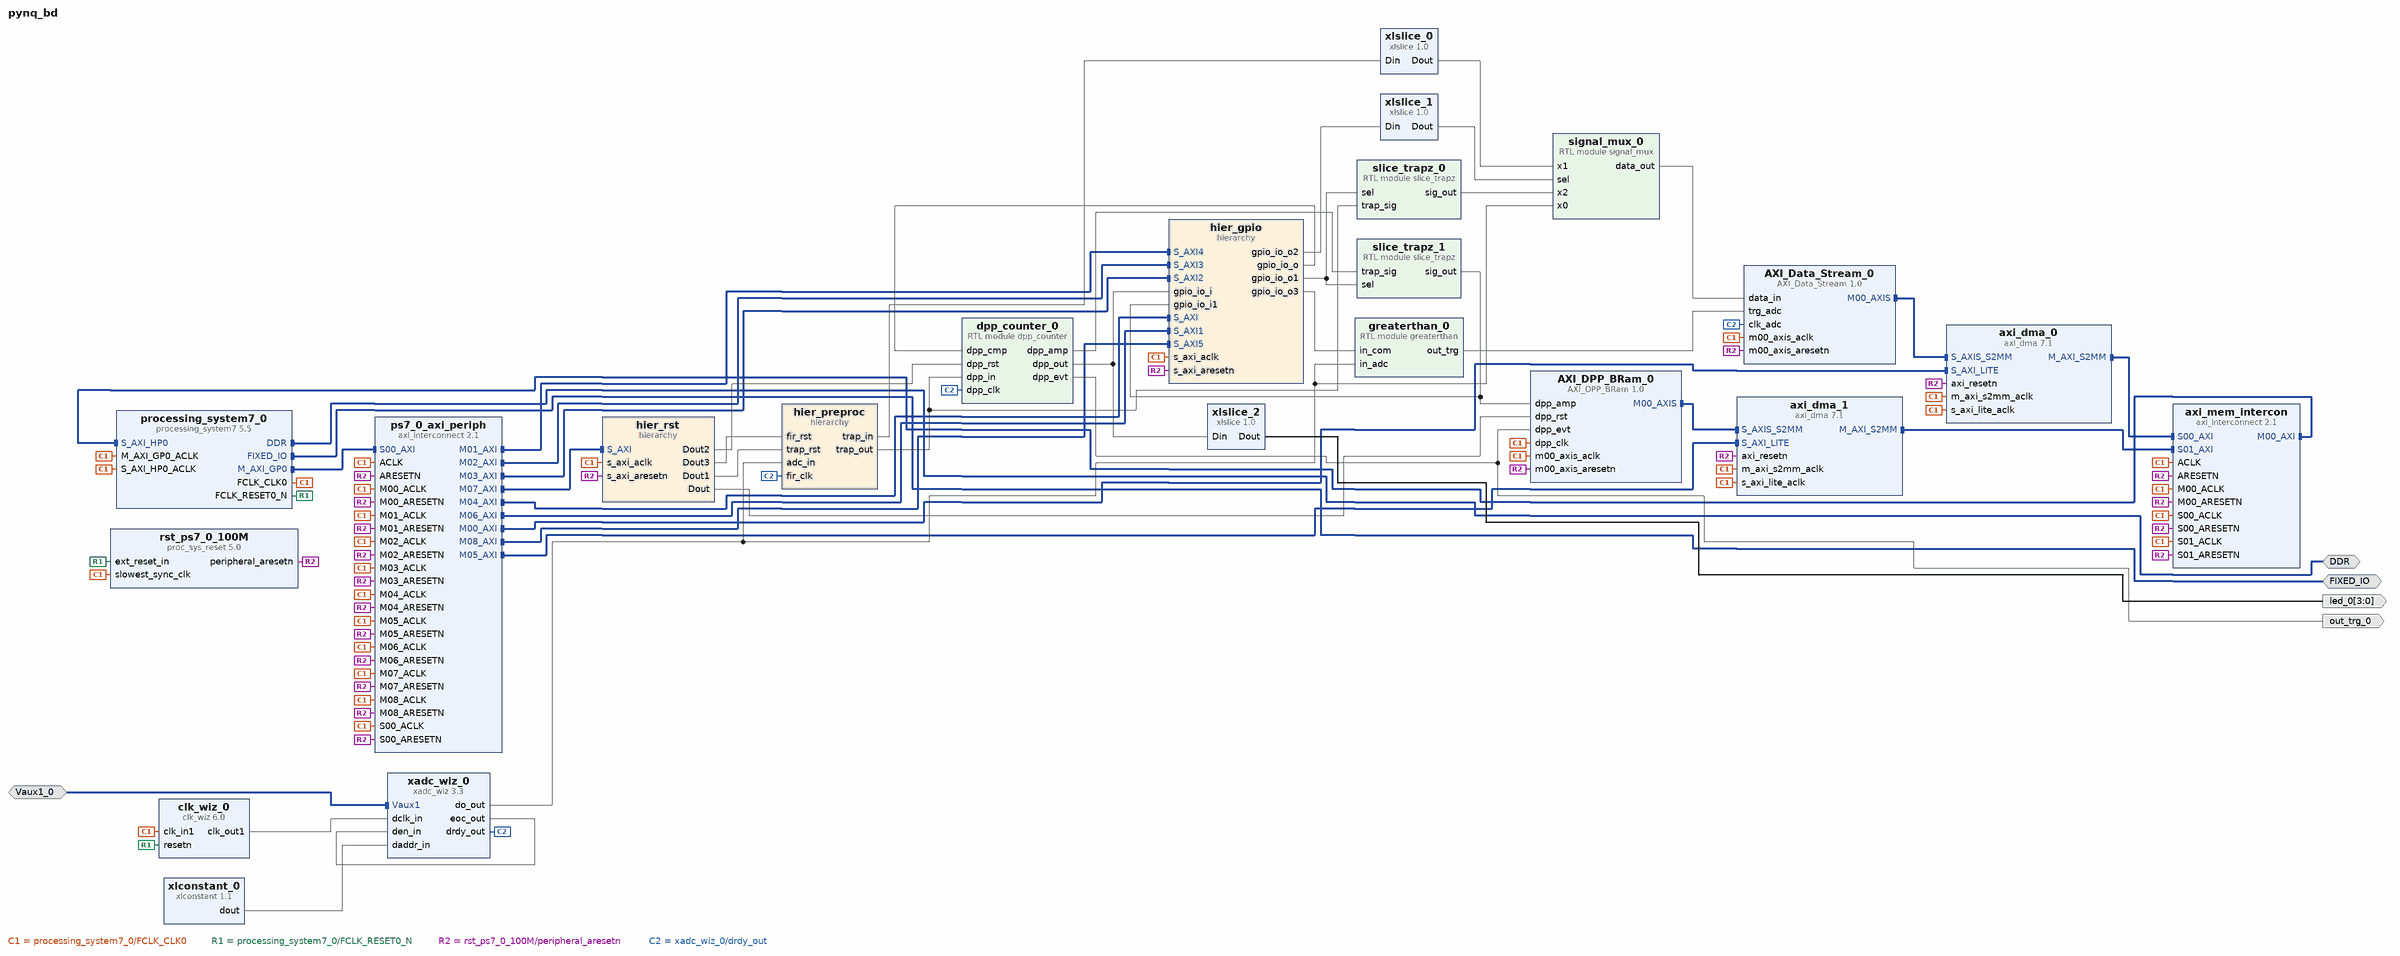
[diagram p0: block diagram of the top level]
# Vivado block design pynq_bd, xc7z020clg400-1, Vivado 2022.2
create_bd_design pynq_bd

create_bd_intf_port -mode Master -vlnv xilinx.com:interface:ddrx_rtl:1.0 DDR
create_bd_intf_port -mode Master -vlnv xilinx.com:display_processing_system7:fixedio_rtl:1.0 FIXED_IO
create_bd_intf_port -mode Slave -vlnv xilinx.com:interface:diff_analog_io_rtl:1.0 Vaux1_0
create_bd_port -dir O -from 3 -to 0 led_0
create_bd_port -dir O out_trg_0

create_bd_cell -type ip -vlnv xilinx.com:ip:processing_system7:5.5 processing_system7_0
set_property -dict [list \
  CONFIG.PCW_APU_PERIPHERAL_FREQMHZ 650 \
  CONFIG.PCW_CRYSTAL_PERIPHERAL_FREQMHZ 50 \
  CONFIG.PCW_ENET0_ENET0_IO {MIO 16 .. 27} \
  CONFIG.PCW_ENET0_GRP_MDIO_ENABLE 1 \
  CONFIG.PCW_ENET0_GRP_MDIO_IO {MIO 52 .. 53} \
  CONFIG.PCW_ENET0_PERIPHERAL_ENABLE 1 \
  CONFIG.PCW_ENET0_RESET_ENABLE 1 \
  CONFIG.PCW_ENET0_RESET_IO {MIO 9} \
  CONFIG.PCW_ENET_RESET_ENABLE 1 \
  CONFIG.PCW_ENET_RESET_SELECT {Share reset pin} \
  CONFIG.PCW_FPGA0_PERIPHERAL_FREQMHZ 100 \
  CONFIG.PCW_FPGA1_PERIPHERAL_FREQMHZ 50 \
  CONFIG.PCW_GPIO_MIO_GPIO_ENABLE 1 \
  CONFIG.PCW_GPIO_MIO_GPIO_IO MIO \
  CONFIG.PCW_I2C_RESET_ENABLE 0 \
  CONFIG.PCW_M_AXI_GP0_FREQMHZ 10 \
  CONFIG.PCW_PERIPHERAL_BOARD_PRESET None \
  CONFIG.PCW_PRESET_BANK1_VOLTAGE {LVCMOS 1.8V} \
  CONFIG.PCW_QSPI_GRP_FBCLK_ENABLE 1 \
  CONFIG.PCW_QSPI_GRP_FBCLK_IO {MIO 8} \
  CONFIG.PCW_QSPI_GRP_SINGLE_SS_ENABLE 1 \
  CONFIG.PCW_QSPI_GRP_SINGLE_SS_IO {MIO 1 .. 6} \
  CONFIG.PCW_QSPI_PERIPHERAL_ENABLE 1 \
  CONFIG.PCW_QSPI_QSPI_IO {MIO 1 .. 6} \
  CONFIG.PCW_SD0_GRP_CD_ENABLE 1 \
  CONFIG.PCW_SD0_GRP_CD_IO {MIO 47} \
  CONFIG.PCW_SD0_GRP_WP_ENABLE 0 \
  CONFIG.PCW_SD0_PERIPHERAL_ENABLE 1 \
  CONFIG.PCW_SD0_SD0_IO {MIO 40 .. 45} \
  CONFIG.PCW_SDIO_PERIPHERAL_FREQMHZ 50 \
  CONFIG.PCW_SINGLE_QSPI_DATA_MODE x4 \
  CONFIG.PCW_S_AXI_HP0_FREQMHZ 10 \
  CONFIG.PCW_UART0_PERIPHERAL_ENABLE 1 \
  CONFIG.PCW_UART0_UART0_IO {MIO 14 .. 15} \
  CONFIG.PCW_UART1_PERIPHERAL_ENABLE 0 \
  CONFIG.PCW_UART_PERIPHERAL_FREQMHZ 100 \
  CONFIG.PCW_UIPARAM_DDR_BUS_WIDTH {16 Bit} \
  CONFIG.PCW_UIPARAM_DDR_FREQ_MHZ 525 \
  CONFIG.PCW_UIPARAM_DDR_PARTNO {MT41J256M16 RE-125} \
  CONFIG.PCW_USB0_PERIPHERAL_ENABLE 1 \
  CONFIG.PCW_USB0_RESET_ENABLE 1 \
  CONFIG.PCW_USB0_RESET_IO {MIO 46} \
  CONFIG.PCW_USB0_USB0_IO {MIO 28 .. 39} \
  CONFIG.PCW_USB_RESET_ENABLE 1 \
  CONFIG.PCW_USB_RESET_SELECT {Share reset pin} \
  CONFIG.PCW_USE_S_AXI_HP0 1 \
] [get_bd_cells processing_system7_0]
# 482 more settings of processing_system7_0 are not shown: defaults, MIO pin electricals, DDR timing, and values the tool derives
create_bd_cell -type ip -vlnv xilinx.com:ip:xadc_wiz:3.3 xadc_wiz_0
set_property -dict [list \
  CONFIG.ADC_CONVERSION_RATE 1000 \
  CONFIG.ADC_OFFSET_AND_GAIN_CALIBRATION true \
  CONFIG.DCLK_FREQUENCY 104 \
  CONFIG.ENABLE_CALIBRATION_AVERAGING true \
  CONFIG.ENABLE_RESET true \
  CONFIG.ENABLE_VCCDDRO_ALARM false \
  CONFIG.ENABLE_VCCPAUX_ALARM false \
  CONFIG.ENABLE_VCCPINT_ALARM false \
  CONFIG.INTERFACE_SELECTION ENABLE_DRP \
  CONFIG.OT_ALARM false \
  CONFIG.SENSOR_OFFSET_AND_GAIN_CALIBRATION true \
  CONFIG.SINGLE_CHANNEL_SELECTION VAUXP1_VAUXN1 \
  CONFIG.USER_TEMP_ALARM false \
  CONFIG.VCCAUX_ALARM false \
  CONFIG.VCCINT_ALARM false \
] [get_bd_cells xadc_wiz_0]
create_bd_cell -type ip -vlnv xilinx.com:ip:clk_wiz:6.0 clk_wiz_0
set_property -dict [list \
  CONFIG.CLKOUT1_JITTER 129.027 \
  CONFIG.CLKOUT1_PHASE_ERROR 99.281 \
  CONFIG.CLKOUT1_REQUESTED_OUT_FREQ 104.000 \
  CONFIG.MMCM_CLKFBOUT_MULT_F 9.750 \
  CONFIG.MMCM_CLKOUT0_DIVIDE_F 9.375 \
  CONFIG.RESET_PORT resetn \
  CONFIG.RESET_TYPE ACTIVE_LOW \
] [get_bd_cells clk_wiz_0]
create_bd_cell -type ip -vlnv xilinx.com:ip:xlconstant:1.1 xlconstant_0
set_property -dict {CONFIG.CONST_VAL 17 CONFIG.CONST_WIDTH 7} [get_bd_cells xlconstant_0]
create_bd_cell -type ip -vlnv xilinx.com:ip:axi_dma:7.1 axi_dma_0
set_property -dict [list \
  CONFIG.c_include_mm2s 0 \
  CONFIG.c_include_sg 0 \
  CONFIG.c_s2mm_burst_size 256 \
  CONFIG.c_sg_length_width 16 \
] [get_bd_cells axi_dma_0]
create_bd_cell -type ip -vlnv xilinx.com:ip:proc_sys_reset:5.0 rst_ps7_0_100M
create_bd_cell -type ip -vlnv xilinx.com:ip:axi_interconnect:2.1 ps7_0_axi_periph
set_property -dict {CONFIG.NUM_MI 9} [get_bd_cells ps7_0_axi_periph]
create_bd_cell -type ip -vlnv xilinx.com:ip:axi_interconnect:2.1 axi_mem_intercon
set_property -dict {CONFIG.NUM_MI 1 CONFIG.NUM_SI 2} [get_bd_cells axi_mem_intercon]
create_bd_cell -type module -reference signal_mux signal_mux_0
create_bd_cell -type ip -vlnv xilinx.com:ip:xlslice:1.0 xlslice_0
set_property -dict {CONFIG.DIN_FROM 15 CONFIG.DIN_TO 0} [get_bd_cells xlslice_0]
create_bd_cell -type ip -vlnv xilinx.com:ip:xlslice:1.0 xlslice_1
set_property -dict {CONFIG.DIN_FROM 1} [get_bd_cells xlslice_1]
create_bd_cell -type ip -vlnv xilinx.com:user:AXI_Data_Stream:1.0 AXI_Data_Stream_0
create_bd_cell -type module -reference greaterthan greaterthan_0
create_bd_cell -type module -reference slice_trapz slice_trapz_0
create_bd_cell -type module -reference slice_trapz slice_trapz_1
create_bd_cell -type ip -vlnv xilinx.com:ip:axi_dma:7.1 axi_dma_1
set_property -dict [list \
  CONFIG.c_include_mm2s 0 \
  CONFIG.c_include_sg 0 \
  CONFIG.c_s2mm_burst_size 256 \
  CONFIG.c_sg_length_width 14 \
] [get_bd_cells axi_dma_1]
create_bd_cell -type ip -vlnv xilinx.com:ip:xlslice:1.0 xlslice_2
set_property -dict {CONFIG.DIN_FROM 3} [get_bd_cells xlslice_2]
create_bd_cell -type hier hier_rst
create_bd_cell -type hier hier_preproc
create_bd_cell -type hier hier_gpio
create_bd_cell -type module -reference dpp_counter dpp_counter_0
create_bd_cell -type ip -vlnv xilinx.com:user:AXI_DPP_BRam:1.0 AXI_DPP_BRam_0

# ---- hierarchy /hier_rst ----
current_bd_instance /hier_rst
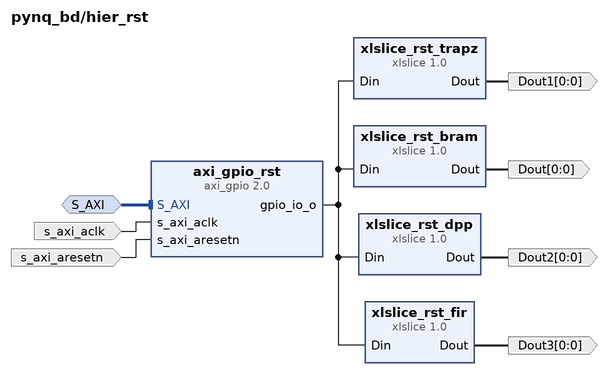
[diagram p1: block diagram inside /hier_rst]
create_bd_intf_pin -mode Slave -vlnv xilinx.com:interface:aximm_rtl:1.0 S_AXI
create_bd_pin -dir I -type clk s_axi_aclk
create_bd_pin -dir I -type rst s_axi_aresetn
create_bd_pin -dir O -from 0 -to 0 Dout
create_bd_pin -dir O -from 0 -to 0 Dout1
create_bd_pin -dir O -from 0 -to 0 Dout2
create_bd_pin -dir O -from 0 -to 0 Dout3

create_bd_cell -type ip -vlnv xilinx.com:ip:axi_gpio:2.0 axi_gpio_rst
create_bd_cell -type ip -vlnv xilinx.com:ip:xlslice:1.0 xlslice_rst_bram
set_property -dict {CONFIG.DIN_FROM 3 CONFIG.DIN_TO 3} [get_bd_cells xlslice_rst_bram]
create_bd_cell -type ip -vlnv xilinx.com:ip:xlslice:1.0 xlslice_rst_trapz
set_property -dict {CONFIG.DIN_FROM 1 CONFIG.DIN_TO 1} [get_bd_cells xlslice_rst_trapz]
create_bd_cell -type ip -vlnv xilinx.com:ip:xlslice:1.0 xlslice_rst_dpp
set_property -dict {CONFIG.DIN_FROM 2 CONFIG.DIN_TO 2} [get_bd_cells xlslice_rst_dpp]
create_bd_cell -type ip -vlnv xilinx.com:ip:xlslice:1.0 xlslice_rst_fir

# ---- hierarchy /hier_preproc ----
current_bd_instance /hier_preproc
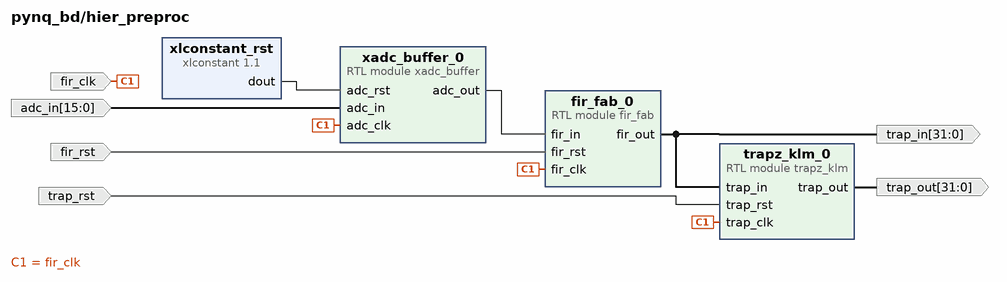
[diagram p2: block diagram inside /hier_preproc]
create_bd_pin -dir I -type clk fir_clk
create_bd_pin -dir I -from 15 -to 0 adc_in
create_bd_pin -dir I -type rst fir_rst
create_bd_pin -dir O -from 31 -to 0 trap_in
create_bd_pin -dir I -type rst trap_rst
create_bd_pin -dir O -from 31 -to 0 trap_out

create_bd_cell -type ip -vlnv xilinx.com:ip:xlconstant:1.1 xlconstant_rst
create_bd_cell -type module -reference xadc_buffer xadc_buffer_0
create_bd_cell -type module -reference fir_fab fir_fab_0
create_bd_cell -type module -reference trapz_klm trapz_klm_0

# ---- hierarchy /hier_gpio ----
current_bd_instance /hier_gpio
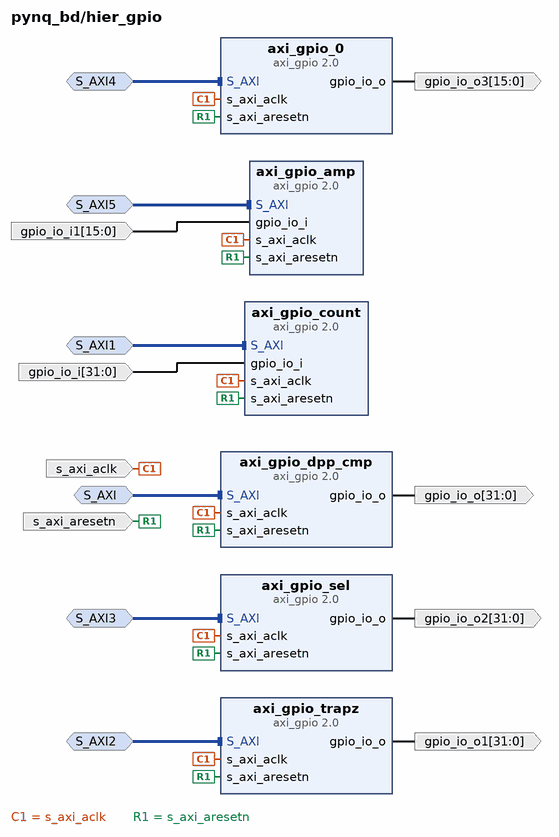
[diagram p3: block diagram inside /hier_gpio]
create_bd_intf_pin -mode Slave -vlnv xilinx.com:interface:aximm_rtl:1.0 S_AXI
create_bd_intf_pin -mode Slave -vlnv xilinx.com:interface:aximm_rtl:1.0 S_AXI1
create_bd_intf_pin -mode Slave -vlnv xilinx.com:interface:aximm_rtl:1.0 S_AXI2
create_bd_intf_pin -mode Slave -vlnv xilinx.com:interface:aximm_rtl:1.0 S_AXI3
create_bd_intf_pin -mode Slave -vlnv xilinx.com:interface:aximm_rtl:1.0 S_AXI4
create_bd_intf_pin -mode Slave -vlnv xilinx.com:interface:aximm_rtl:1.0 S_AXI5
create_bd_pin -dir I -type clk s_axi_aclk
create_bd_pin -dir I -type rst s_axi_aresetn
create_bd_pin -dir O -from 31 -to 0 gpio_io_o
create_bd_pin -dir I -from 31 -to 0 gpio_io_i
create_bd_pin -dir O -from 31 -to 0 gpio_io_o1
create_bd_pin -dir O -from 31 -to 0 gpio_io_o2
create_bd_pin -dir O -from 15 -to 0 gpio_io_o3
create_bd_pin -dir I -from 15 -to 0 gpio_io_i1

create_bd_cell -type ip -vlnv xilinx.com:ip:axi_gpio:2.0 axi_gpio_dpp_cmp
set_property -dict {CONFIG.C_DOUT_DEFAULT 0x0000C350} [get_bd_cells axi_gpio_dpp_cmp]
create_bd_cell -type ip -vlnv xilinx.com:ip:axi_gpio:2.0 axi_gpio_count
create_bd_cell -type ip -vlnv xilinx.com:ip:axi_gpio:2.0 axi_gpio_trapz
create_bd_cell -type ip -vlnv xilinx.com:ip:axi_gpio:2.0 axi_gpio_sel
create_bd_cell -type ip -vlnv xilinx.com:ip:axi_gpio:2.0 axi_gpio_0
set_property -dict {CONFIG.C_DOUT_DEFAULT 0x00000200 CONFIG.C_GPIO_WIDTH 16} [get_bd_cells axi_gpio_0]
create_bd_cell -type ip -vlnv xilinx.com:ip:axi_gpio:2.0 axi_gpio_amp

# ---- connections ----

current_bd_instance /hier_rst
connect_bd_intf_net [get_bd_intf_pins S_AXI] [get_bd_intf_pins axi_gpio_rst/S_AXI]
connect_bd_net [get_bd_pins axi_gpio_rst/gpio_io_o] \
  [get_bd_pins xlslice_rst_fir/Din] [get_bd_pins xlslice_rst_trapz/Din] [get_bd_pins xlslice_rst_dpp/Din] \
  [get_bd_pins xlslice_rst_bram/Din]
connect_bd_net -net processing_system7_0_FCLK_CLK0 [get_bd_pins s_axi_aclk] [get_bd_pins axi_gpio_rst/s_axi_aclk]
connect_bd_net -net rst_ps7_0_100M_peripheral_aresetn [get_bd_pins s_axi_aresetn] [get_bd_pins axi_gpio_rst/s_axi_aresetn]
connect_bd_net [get_bd_pins xlslice_rst_bram/Dout] [get_bd_pins Dout]
connect_bd_net [get_bd_pins xlslice_rst_dpp/Dout] [get_bd_pins Dout2]
connect_bd_net [get_bd_pins xlslice_rst_fir/Dout] [get_bd_pins Dout3]
connect_bd_net [get_bd_pins xlslice_rst_trapz/Dout] [get_bd_pins Dout1]

current_bd_instance /hier_preproc
connect_bd_net [get_bd_pins fir_fab_0/fir_out] [get_bd_pins trap_in] [get_bd_pins trapz_klm_0/trap_in]
connect_bd_net [get_bd_pins trapz_klm_0/trap_out] [get_bd_pins trap_out]
connect_bd_net [get_bd_pins xadc_buffer_0/adc_out] [get_bd_pins fir_fab_0/fir_in]
connect_bd_net -net xadc_wiz_0_do_out [get_bd_pins adc_in] [get_bd_pins xadc_buffer_0/adc_in]
connect_bd_net -net xadc_wiz_0_drdy_out [get_bd_pins fir_clk] \
  [get_bd_pins fir_fab_0/fir_clk] [get_bd_pins trapz_klm_0/trap_clk] [get_bd_pins xadc_buffer_0/adc_clk]
connect_bd_net [get_bd_pins xlconstant_rst/dout] [get_bd_pins xadc_buffer_0/adc_rst]
connect_bd_net -net xlslice_rst_fir_Dout [get_bd_pins fir_rst] [get_bd_pins fir_fab_0/fir_rst]
connect_bd_net -net xlslice_rst_trapz_Dout [get_bd_pins trap_rst] [get_bd_pins trapz_klm_0/trap_rst]

current_bd_instance /hier_gpio
connect_bd_intf_net [get_bd_intf_pins S_AXI5] [get_bd_intf_pins axi_gpio_amp/S_AXI]
connect_bd_intf_net [get_bd_intf_pins S_AXI4] [get_bd_intf_pins axi_gpio_0/S_AXI]
connect_bd_intf_net [get_bd_intf_pins S_AXI3] [get_bd_intf_pins axi_gpio_sel/S_AXI]
connect_bd_intf_net [get_bd_intf_pins S_AXI2] [get_bd_intf_pins axi_gpio_trapz/S_AXI]
connect_bd_intf_net [get_bd_intf_pins S_AXI] [get_bd_intf_pins axi_gpio_dpp_cmp/S_AXI]
connect_bd_intf_net [get_bd_intf_pins S_AXI1] [get_bd_intf_pins axi_gpio_count/S_AXI]
connect_bd_net [get_bd_pins axi_gpio_0/gpio_io_o] [get_bd_pins gpio_io_o3]
connect_bd_net -net axi_gpio_1_gpio_io_o [get_bd_pins axi_gpio_sel/gpio_io_o] [get_bd_pins gpio_io_o2]
connect_bd_net -net axi_gpio_1_gpio_io_o1 [get_bd_pins axi_gpio_trapz/gpio_io_o] [get_bd_pins gpio_io_o1]
connect_bd_net [get_bd_pins axi_gpio_dpp_cmp/gpio_io_o] [get_bd_pins gpio_io_o]
connect_bd_net -net dpp_counter_0_dpp_out [get_bd_pins gpio_io_i] [get_bd_pins axi_gpio_count/gpio_io_i]
connect_bd_net -net gpio_io_i1_1 [get_bd_pins gpio_io_i1] [get_bd_pins axi_gpio_amp/gpio_io_i]
connect_bd_net -net processing_system7_0_FCLK_CLK0 [get_bd_pins s_axi_aclk] \
  [get_bd_pins axi_gpio_0/s_axi_aclk] [get_bd_pins axi_gpio_sel/s_axi_aclk] [get_bd_pins axi_gpio_trapz/s_axi_aclk] \
  [get_bd_pins axi_gpio_count/s_axi_aclk] [get_bd_pins axi_gpio_dpp_cmp/s_axi_aclk] [get_bd_pins axi_gpio_amp/s_axi_aclk]
connect_bd_net -net rst_ps7_0_100M_peripheral_aresetn [get_bd_pins s_axi_aresetn] \
  [get_bd_pins axi_gpio_0/s_axi_aresetn] [get_bd_pins axi_gpio_sel/s_axi_aresetn] [get_bd_pins axi_gpio_trapz/s_axi_aresetn] \
  [get_bd_pins axi_gpio_count/s_axi_aresetn] [get_bd_pins axi_gpio_dpp_cmp/s_axi_aresetn] \
  [get_bd_pins axi_gpio_amp/s_axi_aresetn]

current_bd_instance /
connect_bd_intf_net [get_bd_intf_pins AXI_DPP_BRam_0/M00_AXIS] [get_bd_intf_pins axi_dma_1/S_AXIS_S2MM]
connect_bd_intf_net [get_bd_intf_pins axi_dma_0/S_AXIS_S2MM] [get_bd_intf_pins AXI_Data_Stream_0/M00_AXIS]
connect_bd_intf_net -intf_net Vaux1_0_1 [get_bd_intf_ports Vaux1_0] [get_bd_intf_pins xadc_wiz_0/Vaux1]
connect_bd_intf_net [get_bd_intf_pins axi_dma_0/M_AXI_S2MM] [get_bd_intf_pins axi_mem_intercon/S00_AXI]
connect_bd_intf_net [get_bd_intf_pins axi_dma_1/M_AXI_S2MM] [get_bd_intf_pins axi_mem_intercon/S01_AXI]
connect_bd_intf_net [get_bd_intf_pins axi_mem_intercon/M00_AXI] [get_bd_intf_pins processing_system7_0/S_AXI_HP0]
connect_bd_intf_net [get_bd_intf_ports DDR] [get_bd_intf_pins processing_system7_0/DDR]
connect_bd_intf_net [get_bd_intf_ports FIXED_IO] [get_bd_intf_pins processing_system7_0/FIXED_IO]
connect_bd_intf_net [get_bd_intf_pins processing_system7_0/M_AXI_GP0] [get_bd_intf_pins ps7_0_axi_periph/S00_AXI]
connect_bd_intf_net [get_bd_intf_pins ps7_0_axi_periph/M00_AXI] [get_bd_intf_pins axi_dma_0/S_AXI_LITE]
connect_bd_intf_net [get_bd_intf_pins ps7_0_axi_periph/M01_AXI] [get_bd_intf_pins hier_gpio/S_AXI4]
connect_bd_intf_net [get_bd_intf_pins ps7_0_axi_periph/M02_AXI] [get_bd_intf_pins hier_gpio/S_AXI3]
connect_bd_intf_net [get_bd_intf_pins ps7_0_axi_periph/M03_AXI] [get_bd_intf_pins hier_gpio/S_AXI2]
connect_bd_intf_net [get_bd_intf_pins ps7_0_axi_periph/M04_AXI] [get_bd_intf_pins hier_gpio/S_AXI]
connect_bd_intf_net [get_bd_intf_pins ps7_0_axi_periph/M05_AXI] [get_bd_intf_pins axi_dma_1/S_AXI_LITE]
connect_bd_intf_net [get_bd_intf_pins ps7_0_axi_periph/M06_AXI] [get_bd_intf_pins hier_gpio/S_AXI1]
connect_bd_intf_net [get_bd_intf_pins ps7_0_axi_periph/M07_AXI] [get_bd_intf_pins hier_rst/S_AXI]
connect_bd_intf_net [get_bd_intf_pins ps7_0_axi_periph/M08_AXI] [get_bd_intf_pins hier_gpio/S_AXI5]
connect_bd_net -net axi_gpio_0_gpio_io_o [get_bd_pins hier_gpio/gpio_io_o3] [get_bd_pins greaterthan_0/in_com]
connect_bd_net -net axi_gpio_1_gpio_io_o [get_bd_pins hier_gpio/gpio_io_o2] [get_bd_pins xlslice_1/Din]
connect_bd_net -net axi_gpio_1_gpio_io_o1 [get_bd_pins hier_gpio/gpio_io_o1] [get_bd_pins slice_trapz_0/sel] [get_bd_pins slice_trapz_1/sel]
connect_bd_net -net axi_gpio_dpp_cmp_gpio_io_o [get_bd_pins hier_gpio/gpio_io_o] [get_bd_pins dpp_counter_0/dpp_cmp]
connect_bd_net [get_bd_pins clk_wiz_0/clk_out1] [get_bd_pins xadc_wiz_0/dclk_in]
connect_bd_net [get_bd_pins dpp_counter_0/dpp_amp] [get_bd_pins slice_trapz_1/trap_sig]
connect_bd_net [get_bd_pins dpp_counter_0/dpp_evt] [get_bd_ports out_trg_0] [get_bd_pins AXI_DPP_BRam_0/dpp_evt]
connect_bd_net [get_bd_pins dpp_counter_0/dpp_out] [get_bd_pins xlslice_2/Din] [get_bd_pins hier_gpio/gpio_io_i]
connect_bd_net -net fir_fab_0_fir_out [get_bd_pins hier_preproc/trap_in] [get_bd_pins xlslice_0/Din]
connect_bd_net [get_bd_pins greaterthan_0/out_trg] [get_bd_pins AXI_Data_Stream_0/trg_adc]
connect_bd_net [get_bd_pins processing_system7_0/FCLK_CLK0] \
  [get_bd_pins clk_wiz_0/clk_in1] [get_bd_pins axi_dma_0/m_axi_s2mm_aclk] [get_bd_pins rst_ps7_0_100M/slowest_sync_clk] \
  [get_bd_pins ps7_0_axi_periph/ACLK] [get_bd_pins processing_system7_0/M_AXI_GP0_ACLK] \
  [get_bd_pins ps7_0_axi_periph/S00_ACLK] [get_bd_pins axi_dma_0/s_axi_lite_aclk] [get_bd_pins ps7_0_axi_periph/M00_ACLK] \
  [get_bd_pins ps7_0_axi_periph/M01_ACLK] [get_bd_pins axi_mem_intercon/ACLK] [get_bd_pins axi_mem_intercon/S00_ACLK] \
  [get_bd_pins processing_system7_0/S_AXI_HP0_ACLK] [get_bd_pins axi_mem_intercon/M00_ACLK] \
  [get_bd_pins ps7_0_axi_periph/M02_ACLK] [get_bd_pins ps7_0_axi_periph/M03_ACLK] \
  [get_bd_pins AXI_Data_Stream_0/m00_axis_aclk] [get_bd_pins ps7_0_axi_periph/M04_ACLK] \
  [get_bd_pins axi_dma_1/m_axi_s2mm_aclk] [get_bd_pins axi_mem_intercon/S01_ACLK] [get_bd_pins axi_dma_1/s_axi_lite_aclk] \
  [get_bd_pins ps7_0_axi_periph/M05_ACLK] [get_bd_pins ps7_0_axi_periph/M06_ACLK] [get_bd_pins ps7_0_axi_periph/M07_ACLK] \
  [get_bd_pins hier_rst/s_axi_aclk] [get_bd_pins hier_gpio/s_axi_aclk] [get_bd_pins ps7_0_axi_periph/M08_ACLK] \
  [get_bd_pins AXI_DPP_BRam_0/dpp_clk] [get_bd_pins AXI_DPP_BRam_0/m00_axis_aclk]
connect_bd_net [get_bd_pins processing_system7_0/FCLK_RESET0_N] [get_bd_pins clk_wiz_0/resetn] [get_bd_pins rst_ps7_0_100M/ext_reset_in]
connect_bd_net [get_bd_pins rst_ps7_0_100M/peripheral_aresetn] \
  [get_bd_pins ps7_0_axi_periph/S00_ARESETN] [get_bd_pins axi_dma_0/axi_resetn] [get_bd_pins ps7_0_axi_periph/M00_ARESETN] \
  [get_bd_pins ps7_0_axi_periph/ARESETN] [get_bd_pins ps7_0_axi_periph/M01_ARESETN] \
  [get_bd_pins axi_mem_intercon/S00_ARESETN] [get_bd_pins axi_mem_intercon/M00_ARESETN] \
  [get_bd_pins axi_mem_intercon/ARESETN] [get_bd_pins ps7_0_axi_periph/M02_ARESETN] \
  [get_bd_pins ps7_0_axi_periph/M03_ARESETN] [get_bd_pins AXI_Data_Stream_0/m00_axis_aresetn] \
  [get_bd_pins ps7_0_axi_periph/M04_ARESETN] [get_bd_pins axi_mem_intercon/S01_ARESETN] [get_bd_pins axi_dma_1/axi_resetn] \
  [get_bd_pins ps7_0_axi_periph/M05_ARESETN] [get_bd_pins ps7_0_axi_periph/M06_ARESETN] \
  [get_bd_pins ps7_0_axi_periph/M07_ARESETN] [get_bd_pins hier_rst/s_axi_aresetn] [get_bd_pins hier_gpio/s_axi_aresetn] \
  [get_bd_pins ps7_0_axi_periph/M08_ARESETN] [get_bd_pins AXI_DPP_BRam_0/m00_axis_aresetn]
connect_bd_net [get_bd_pins signal_mux_0/data_out] [get_bd_pins AXI_Data_Stream_0/data_in]
connect_bd_net [get_bd_pins slice_trapz_0/sig_out] [get_bd_pins signal_mux_0/x2]
connect_bd_net [get_bd_pins slice_trapz_1/sig_out] [get_bd_pins hier_gpio/gpio_io_i1] [get_bd_pins AXI_DPP_BRam_0/dpp_amp]
connect_bd_net -net trapz_klm_0_trap_out [get_bd_pins hier_preproc/trap_out] [get_bd_pins slice_trapz_0/trap_sig] [get_bd_pins dpp_counter_0/dpp_in]
connect_bd_net [get_bd_pins xadc_wiz_0/do_out] [get_bd_pins signal_mux_0/x0] [get_bd_pins greaterthan_0/in_adc] [get_bd_pins hier_preproc/adc_in]
connect_bd_net [get_bd_pins xadc_wiz_0/drdy_out] \
  [get_bd_pins AXI_Data_Stream_0/clk_adc] [get_bd_pins hier_preproc/fir_clk] [get_bd_pins dpp_counter_0/dpp_clk]
connect_bd_net [get_bd_pins xadc_wiz_0/eoc_out] [get_bd_pins xadc_wiz_0/den_in]
connect_bd_net [get_bd_pins xlconstant_0/dout] [get_bd_pins xadc_wiz_0/daddr_in]
connect_bd_net [get_bd_pins xlslice_0/Dout] [get_bd_pins signal_mux_0/x1]
connect_bd_net [get_bd_pins xlslice_1/Dout] [get_bd_pins signal_mux_0/sel]
connect_bd_net [get_bd_pins xlslice_2/Dout] [get_bd_ports led_0]
connect_bd_net -net xlslice_rst_bram_Dout [get_bd_pins hier_rst/Dout] [get_bd_pins AXI_DPP_BRam_0/dpp_rst]
connect_bd_net -net xlslice_rst_dpp_Dout [get_bd_pins hier_rst/Dout2] [get_bd_pins dpp_counter_0/dpp_rst]
connect_bd_net -net xlslice_rst_fir_Dout [get_bd_pins hier_rst/Dout3] [get_bd_pins hier_preproc/fir_rst]
connect_bd_net -net xlslice_rst_trapz_Dout [get_bd_pins hier_rst/Dout1] [get_bd_pins hier_preproc/trap_rst]

# ---- address map ----
assign_bd_address -offset 0x00000000 -range 512M -target_address_space [get_bd_addr_spaces axi_dma_0/Data_S2MM] [get_bd_addr_segs processing_system7_0/S_AXI_HP0/HP0_DDR_LOWOCM]
assign_bd_address -offset 0x00000000 -range 512M -target_address_space [get_bd_addr_spaces axi_dma_1/Data_S2MM] [get_bd_addr_segs processing_system7_0/S_AXI_HP0/HP0_DDR_LOWOCM]
assign_bd_address -offset 0x40400000 -range 64K -target_address_space [get_bd_addr_spaces processing_system7_0/Data] [get_bd_addr_segs axi_dma_0/S_AXI_LITE/Reg]
assign_bd_address -offset 0x40410000 -range 64K -target_address_space [get_bd_addr_spaces processing_system7_0/Data] [get_bd_addr_segs axi_dma_1/S_AXI_LITE/Reg]
assign_bd_address -offset 0x41200000 -range 64K -target_address_space [get_bd_addr_spaces processing_system7_0/Data] [get_bd_addr_segs hier_gpio/axi_gpio_0/S_AXI/Reg]
assign_bd_address -offset 0x41210000 -range 64K -target_address_space [get_bd_addr_spaces processing_system7_0/Data] [get_bd_addr_segs hier_gpio/axi_gpio_sel/S_AXI/Reg]
assign_bd_address -offset 0x41220000 -range 64K -target_address_space [get_bd_addr_spaces processing_system7_0/Data] [get_bd_addr_segs hier_gpio/axi_gpio_trapz/S_AXI/Reg]
assign_bd_address -offset 0x41230000 -range 64K -target_address_space [get_bd_addr_spaces processing_system7_0/Data] [get_bd_addr_segs hier_gpio/axi_gpio_dpp_cmp/S_AXI/Reg]
assign_bd_address -offset 0x41240000 -range 64K -target_address_space [get_bd_addr_spaces processing_system7_0/Data] [get_bd_addr_segs hier_gpio/axi_gpio_count/S_AXI/Reg]
assign_bd_address -offset 0x41250000 -range 64K -target_address_space [get_bd_addr_spaces processing_system7_0/Data] [get_bd_addr_segs hier_rst/axi_gpio_rst/S_AXI/Reg]
assign_bd_address -offset 0x41260000 -range 64K -target_address_space [get_bd_addr_spaces processing_system7_0/Data] [get_bd_addr_segs hier_gpio/axi_gpio_amp/S_AXI/Reg]

validate_bd_design
save_bd_design
